# Altium schematic sheet BANK3.SchDoc
size A4
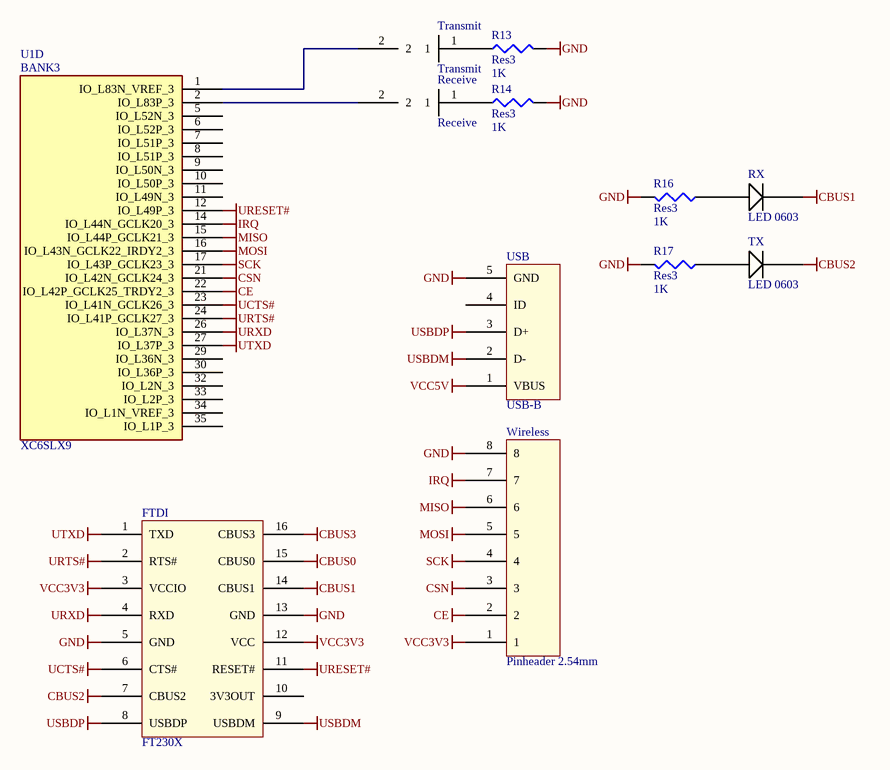
[diagram p0: BANK3.SchDoc]

## Parts
FTDI  FT230X  [FT230X]
R13  Res3  value 1K  [J1-0603]
R14  Res3  value 1K  [J1-0603]
R16  Res3  value 1K  [J1-0603]
R17  Res3  value 1K  [J1-0603]
Receive  Receive  [LED]
RX  LED 0603  [LED]
Transmit  Transmit  [LED]
TX  LED 0603  [LED]
U1  XC6SLX9  [XC6SLX9]  (part D of 6)
USB  USB-B  [USB-B mini]
Wireless  Pinheader 2.54mm  [Pinheader 2.54mm]

## Nets
CBUS0: FTDI.15(CBUS0)
CBUS1: FTDI.14(CBUS1) RX.2
CBUS2: FTDI.7(CBUS2) TX.2
CBUS3: FTDI.16(CBUS3)
CE: U1.22(IO_L42P_GCLK25_TRDY2_3) Wireless.2
CSN: U1.21(IO_L42N_GCLK24_3) Wireless.3
GND: FTDI.5(GND) FTDI.13(GND) R13.2 R14.2 R16.2 R17.2 USB.5(GND) Wireless.8
IRQ: U1.14(IO_L44N_GCLK20_3) Wireless.7
MISO: U1.15(IO_L44P_GCLK21_3) Wireless.6
MOSI: U1.16(IO_L43N_GCLK22_IRDY2_3) Wireless.5
SCK: U1.17(IO_L43P_GCLK23_3) Wireless.4
UCTS#: FTDI.6(CTS#) U1.23(IO_L41N_GCLK26_3)
URESET#: FTDI.11(RESET#) U1.12(IO_L49P_3)
URTS#: FTDI.2(RTS#) U1.24(IO_L41P_GCLK27_3)
URXD: FTDI.4(RXD) U1.26(IO_L37N_3)
USBDM: FTDI.9(USBDM) USB.2(D-)
USBDP: FTDI.8(USBDP) USB.3(D+)
UTXD: FTDI.1(TXD) U1.27(IO_L37P_3)
VCC3V3: FTDI.3(VCCIO) FTDI.12(VCC) Wireless.1
VCC5V: USB.1(VBUS)
NetR13_1: R13.1 Transmit.1
NetR14_1: R14.1 Receive.1
NetR16_1: R16.1 RX.1
NetR17_1: R17.1 TX.1
NetReceive_2: Receive.2 U1.2(IO_L83P_3)
NetTransmit_2: Transmit.2 U1.1(IO_L83N_VREF_3)

Not connected (* = marked no-connect by the designer): FTDI 10(3V3OUT); U1 5(IO_L52N_3) 6(IO_L52P_3) 7(IO_L51P_3) 8(IO_L51P_3) 9(IO_L50N_3) 10(IO_L50P_3) 11(IO_L49N_3) 29(IO_L36N_3) 30(IO_L36P_3) 32(IO_L2N_3) 33(IO_L2P_3) 34(IO_L1N_VREF_3) 35(IO_L1P_3); USB 4(ID)

## Notes on the sheet
- (in symbol C6SLX9, part D) BANK3

## Library data of the parts
R13 R14 R16 R17 = Res3: Resistor; Published: 8-Jun-2000; LatestRevisionDate: 29-May-2009; LatestRevisionNote: IPC-7351 Footprint Added.; PackageReference: J1-0603; Publisher: Altium Limited; PackageDescription: Chip Resistor
Receive Transmit = LED 0603
U1 = C6SLX9: Imported